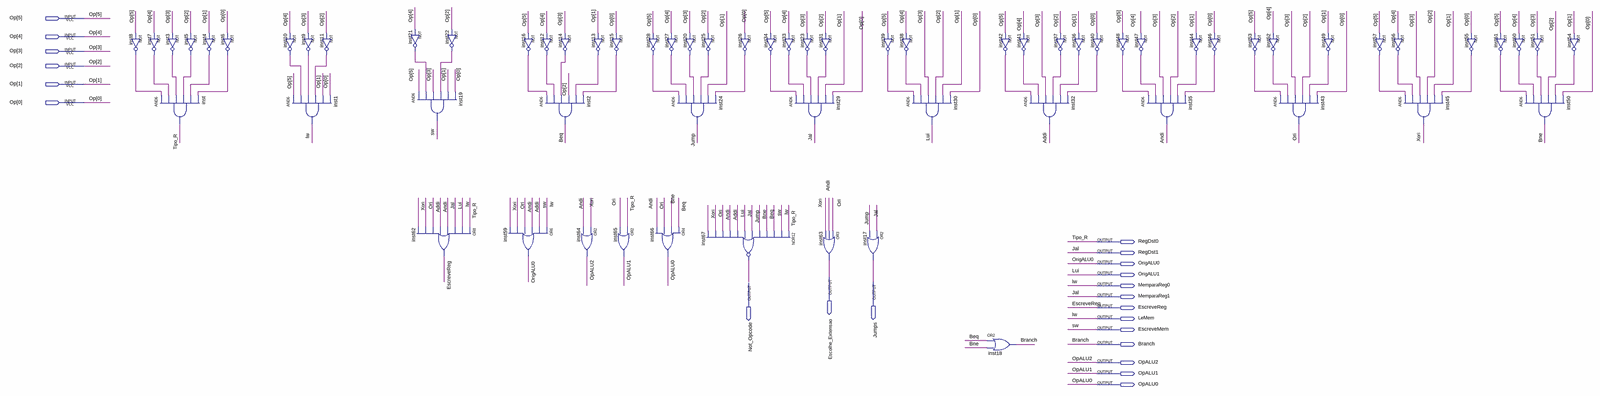
[diagram p0: schematic sheet, whole]
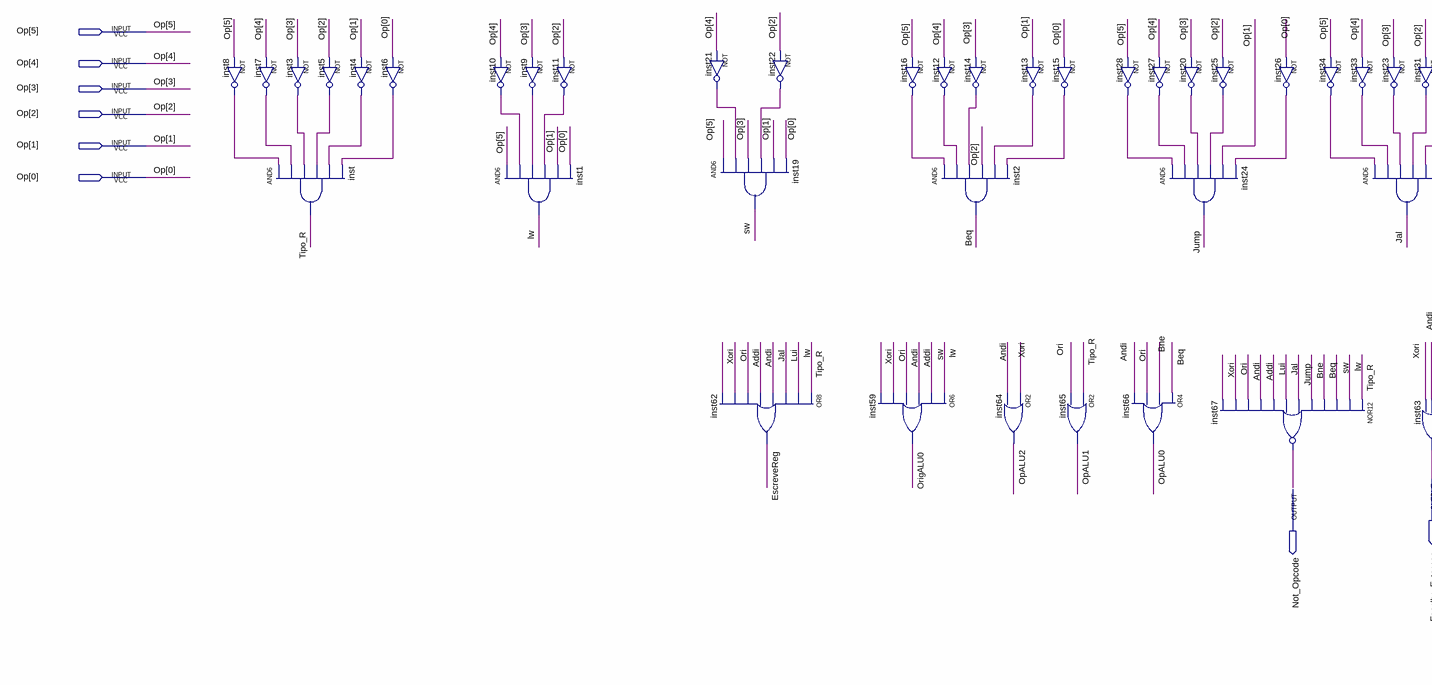
[diagram p1: schematic sheet, left part]
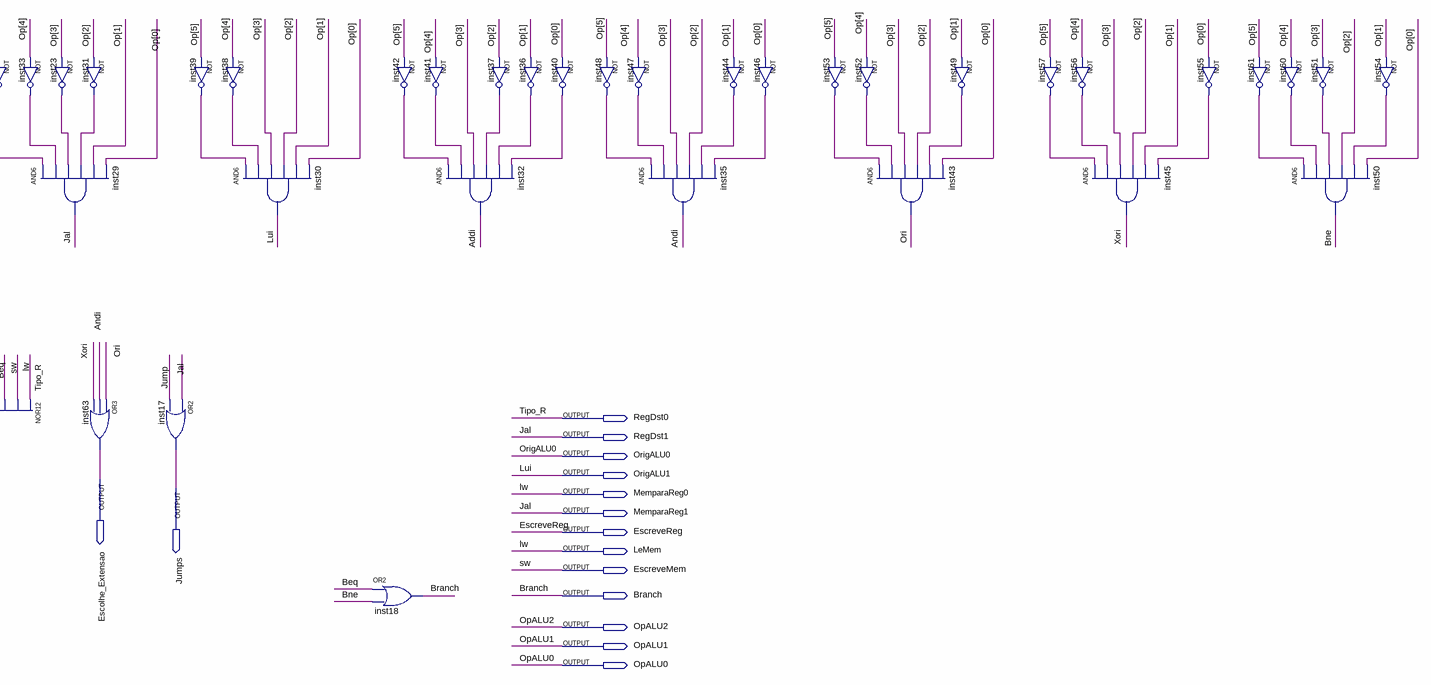
[diagram p2: schematic sheet, right part]
// Quartus schematic CONTROLE.bdf as structural Verilog: 67 symbols, 22 pins
module CONTROLE (
  input  [5:0] Op,
  output RegDst0,
  output RegDst1,
  output OrigALU0,
  output OrigALU1,
  output Escolhe_Extensao,
  output Not_Opcode,
  output Jumps,
  output MemparaReg0,
  output MemparaReg1,
  output EscreveReg,
  output LeMem,
  output EscreveMem,
  output Branch,
  output OpALU2,
  output OpALU1,
  output OpALU0
);

  wire Addi, Andi, Beq, Bne, inst3_out, inst4_out, inst5_out, inst6_out, inst7_out, inst8_out, inst9_out,
       inst10_out, inst11_out, inst12_out, inst13_out, inst14_out, inst15_out, inst16_out, inst20_out,
       inst21_out, inst22_out, inst23_out, inst25_out, inst26_out, inst27_out, inst28_out, inst31_out,
       inst33_out, inst34_out, inst36_out, inst37_out, inst38_out, inst39_out, inst40_out, inst41_out,
       inst42_out, inst44_out, inst46_out, inst47_out, inst48_out, inst49_out, inst51_out, inst52_out,
       inst53_out, inst54_out, inst55_out, inst56_out, inst57_out, inst60_out, inst61_out, Jump, Ori, Xori;

  not inst8 (inst8_out, Op[5]);
  not inst3 (inst3_out, Op[3]);
  not inst7 (inst7_out, Op[4]);
  and inst (RegDst0, inst8_out, inst7_out, inst3_out, inst5_out, inst4_out, inst6_out);
  not inst5 (inst5_out, Op[2]);
  not inst4 (inst4_out, Op[1]);
  not inst6 (inst6_out, Op[0]);
  not inst10 (inst10_out, Op[4]);
  not inst9 (inst9_out, Op[3]);
  and inst1 (LeMem, Op[5], inst10_out, inst9_out, inst11_out, Op[1], Op[0]);
  not inst11 (inst11_out, Op[2]);
  not inst21 (inst21_out, Op[4]);
  and inst19 (EscreveMem, Op[5], inst21_out, Op[3], inst22_out, Op[1], Op[0]);
  or inst62 (EscreveReg, RegDst0, LeMem, OrigALU1, MemparaReg1, Andi, Addi, Ori, Xori);
  not inst22 (inst22_out, Op[2]);
  or inst59 (OrigALU0, LeMem, EscreveMem, Addi, Andi, Ori, Xori);
  not inst12 (inst12_out, Op[4]);
  not inst16 (inst16_out, Op[5]);
  and inst2 (Beq, inst16_out, inst12_out, inst14_out, Op[2], inst13_out, inst15_out);
  not inst14 (inst14_out, Op[3]);
  or inst64 (OpALU2, Xori, Andi);
  not inst13 (inst13_out, Op[1]);
  not inst15 (inst15_out, Op[0]);
  or inst65 (OpALU1, RegDst0, Ori);
  not inst27 (inst27_out, Op[4]);
  not inst28 (inst28_out, Op[5]);
  or inst66 (OpALU0, Beq, Bne, Ori, Andi);
  not inst20 (inst20_out, Op[3]);
  and inst24 (Jump, inst28_out, inst27_out, inst20_out, inst25_out, Op[1], inst26_out);
  not inst25 (inst25_out, Op[2]);
  nor inst67 (Not_Opcode, RegDst0, LeMem, EscreveMem, Beq, Bne, Jump, MemparaReg1, OrigALU1, Addi, Andi, Ori, Xori);
  not inst26 (inst26_out, Op[0]);
  not inst33 (inst33_out, Op[4]);
  not inst34 (inst34_out, Op[5]);
  not inst23 (inst23_out, Op[3]);
  and inst29 (MemparaReg1, inst34_out, inst33_out, inst23_out, inst31_out, Op[1], Op[0]);
  not inst31 (inst31_out, Op[2]);
  or inst63 (Escolhe_Extensao, Ori, Andi, Xori);
  or inst17 (Jumps, MemparaReg1, Jump);
  not inst38 (inst38_out, Op[4]);
  not inst39 (inst39_out, Op[5]);
  and inst30 (OrigALU1, inst39_out, inst38_out, Op[3], Op[2], Op[1], Op[0]);
  or inst18 (Branch, Beq, Bne);
  not inst41 (inst41_out, Op[4]);
  not inst42 (inst42_out, Op[5]);
  and inst32 (Addi, inst42_out, inst41_out, Op[3], inst37_out, inst36_out, inst40_out);
  not inst36 (inst36_out, Op[1]);
  not inst37 (inst37_out, Op[2]);
  not inst40 (inst40_out, Op[0]);
  not inst47 (inst47_out, Op[4]);
  not inst48 (inst48_out, Op[5]);
  and inst35 (Andi, inst48_out, inst47_out, Op[3], Op[2], inst44_out, inst46_out);
  not inst44 (inst44_out, Op[1]);
  not inst46 (inst46_out, Op[0]);
  not inst53 (inst53_out, Op[5]);
  not inst52 (inst52_out, Op[4]);
  and inst43 (Ori, inst53_out, inst52_out, Op[3], Op[2], inst49_out, Op[0]);
  not inst49 (inst49_out, Op[1]);
  not inst56 (inst56_out, Op[4]);
  not inst57 (inst57_out, Op[5]);
  and inst45 (Xori, inst57_out, inst56_out, Op[3], Op[2], Op[1], inst55_out);
  not inst55 (inst55_out, Op[0]);
  not inst60 (inst60_out, Op[4]);
  not inst61 (inst61_out, Op[5]);
  not inst51 (inst51_out, Op[3]);
  and inst50 (Bne, inst61_out, inst60_out, inst51_out, Op[2], inst54_out, Op[0]);
  not inst54 (inst54_out, Op[1]);

  assign MemparaReg0 = LeMem;
  assign RegDst1 = MemparaReg1;

  // Other names for the same wires on the sheet: Jal = MemparaReg1; Lui = OrigALU1; lw = LeMem; sw = EscreveMem;
  //   Tipo_R = RegDst0
endmodule
